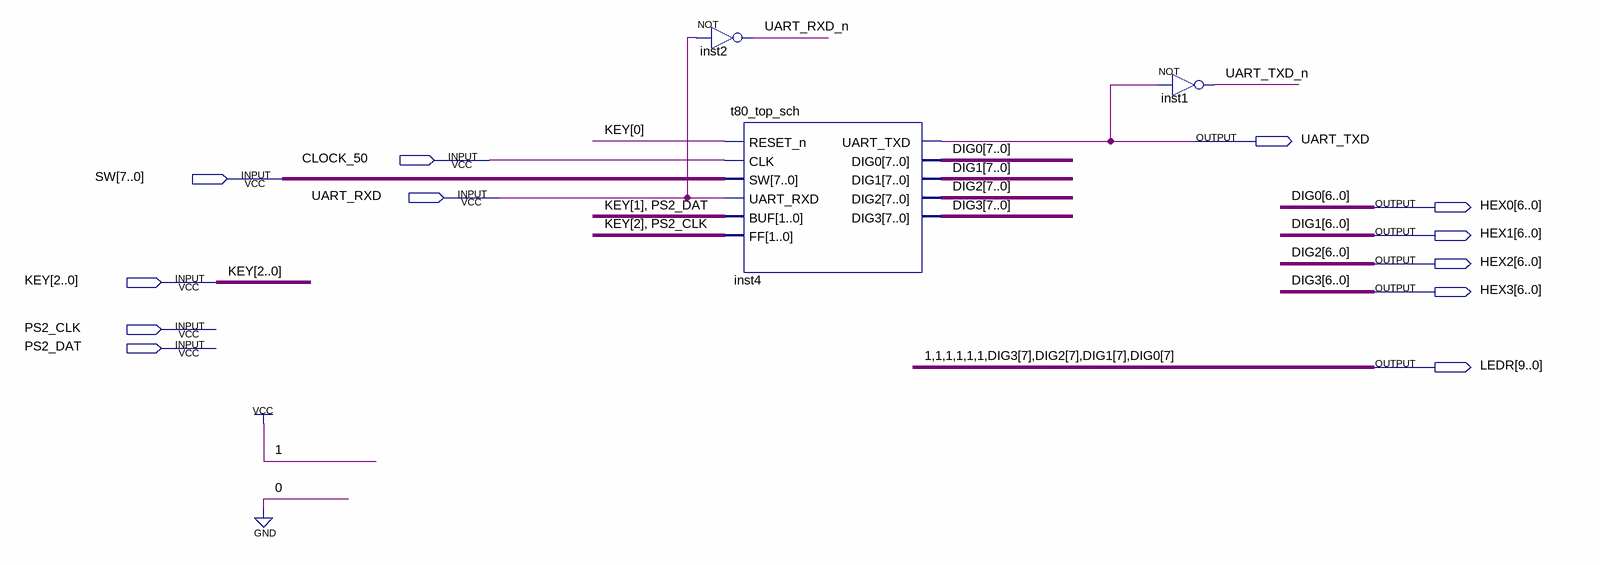
[diagram p0: schematic sheet]
// Quartus schematic t80_top_top_sch.bdf as structural Verilog: 3 symbols, 12 pins
module t80_top_top_sch (
  input  CLOCK_50,
  input  [7:0] SW,
  input  UART_RXD,
  input  [2:0] KEY,
  input  PS2_CLK,
  input  PS2_DAT,
  output UART_TXD,
  output [6:0] HEX0,
  output [6:0] HEX1,
  output [6:0] HEX2,
  output [6:0] HEX3,
  output [9:0] LEDR
);

  wire UART_RXD_n, UART_TXD_n;

  not inst2 (UART_RXD_n, UART_RXD);
  t80_top_sch inst4 (
    .RESET_n(KEY[0]), .CLK(CLOCK_50), .SW(SW), .UART_RXD(UART_RXD), .BUF({KEY[1], PS2_DAT}),
    .FF({KEY[2], PS2_CLK}), .UART_TXD(UART_TXD), .DIG0({LEDR[0], HEX0}), .DIG1({LEDR[1], HEX1}),
    .DIG2({LEDR[2], HEX2}), .DIG3({LEDR[3], HEX3}));
  not inst1 (UART_TXD_n, UART_TXD);

  assign LEDR[9:4] = {6{1'b1}};

  // Other names for the same wires on the sheet: DIG0[7:0] = {LEDR[0], HEX0}; DIG1[7:0] = {LEDR[1], HEX1};
  //   DIG2[7:0] = {LEDR[2], HEX2}; DIG3[7:0] = {LEDR[3], HEX3}
endmodule
